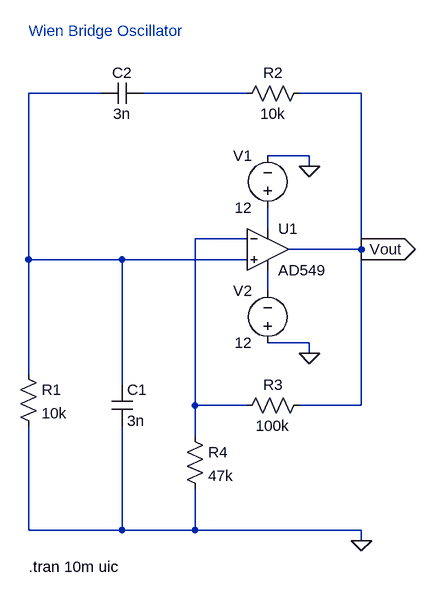
[diagram p0: schematic Wien Bridge Oscillator.asc]
Wien Bridge Oscillator.asc, the LTspice schematic file:
Version 4.1
SHEET 1 880 696
WIRE 32 -48 -80 -48
WIRE 256 -48 96 -48
WIRE 432 -48 336 -48
WIRE 352 48 288 48
WIRE 352 64 352 48
WIRE 288 160 288 128
WIRE 256 176 176 176
WIRE 432 192 432 -48
WIRE 432 192 320 192
WIRE -80 208 -80 -48
WIRE 64 208 -80 208
WIRE 256 208 64 208
WIRE 288 256 288 224
WIRE 352 336 288 336
WIRE 352 352 352 336
WIRE -80 384 -80 208
WIRE 64 400 64 208
WIRE 176 432 176 176
WIRE 256 432 176 432
WIRE 432 432 432 192
WIRE 432 432 336 432
WIRE 176 480 176 432
WIRE -80 624 -80 464
WIRE 64 624 64 464
WIRE 64 624 -80 624
WIRE 176 624 176 560
WIRE 176 624 64 624
WIRE 432 624 176 624
WIRE 432 640 432 624
FLAG 352 352 0
FLAG 352 64 0
FLAG 432 640 0
FLAG 432 192 Vout
IOPIN 432 192 Out
SYMBOL voltage 288 144 R180
WINDOW 0 24 96 Left 2
WINDOW 3 24 16 Left 2
WINDOW 123 0 0 Left 0
WINDOW 39 0 0 Left 0
SYMATTR InstName V1
SYMATTR Value 12
SYMBOL voltage 288 352 R180
WINDOW 0 24 96 Left 2
WINDOW 3 24 16 Left 2
WINDOW 123 0 0 Left 0
WINDOW 39 0 0 Left 0
SYMATTR InstName V2
SYMATTR Value 12
SYMBOL res -96 368 R0
SYMATTR InstName R1
SYMATTR Value 10k
SYMBOL res 352 -64 R90
WINDOW 0 0 56 VBottom 2
WINDOW 3 32 56 VTop 2
SYMATTR InstName R2
SYMATTR Value 10k
SYMBOL res 352 416 R90
WINDOW 0 0 56 VBottom 2
WINDOW 3 32 56 VTop 2
SYMATTR InstName R3
SYMATTR Value 100k
SYMBOL res 160 464 R0
SYMATTR InstName R4
SYMATTR Value 47k
SYMBOL cap 48 400 R0
SYMATTR InstName C1
SYMATTR Value 3n
SYMBOL cap 96 -64 R90
WINDOW 0 0 32 VBottom 2
WINDOW 3 32 32 VTop 2
SYMATTR InstName C2
SYMATTR Value 3n
SYMBOL OpAmps\\AD549 288 128 R0
SYMATTR InstName U1
TEXT -80 -144 Left 2 ;Wien Bridge Oscillator
TEXT -80 680 Left 2 !.tran 10m uic

The netlist it stands for:
* Wien Bridge Oscillator.asc
V1 N003 0 12
V2 0 N005 12
R1 N001 0 10k
R2 Vout N002 10k
R3 Vout N004 100k
R4 N004 0 47k
C1 N001 0 3n
C2 N002 N001 3n
X§U1 N001 N004 N003 N005 Vout AD549  ; pins In+ In- V+ V- OUT
* Wien Bridge Oscillator
.tran 10m uic
.backanno
.end